# EasyEDA schematic SCH_PROJETO-AFC-(LAYOUT-ATUALIZADO-002)_2026-01-30.json
TITLE: AFC TEENSY; REV: 1.0; Date: 2026-01-28; Sheet: 1/1; Drawn By: ALLYSON TULIO; Company: ALPHA SUBSEA
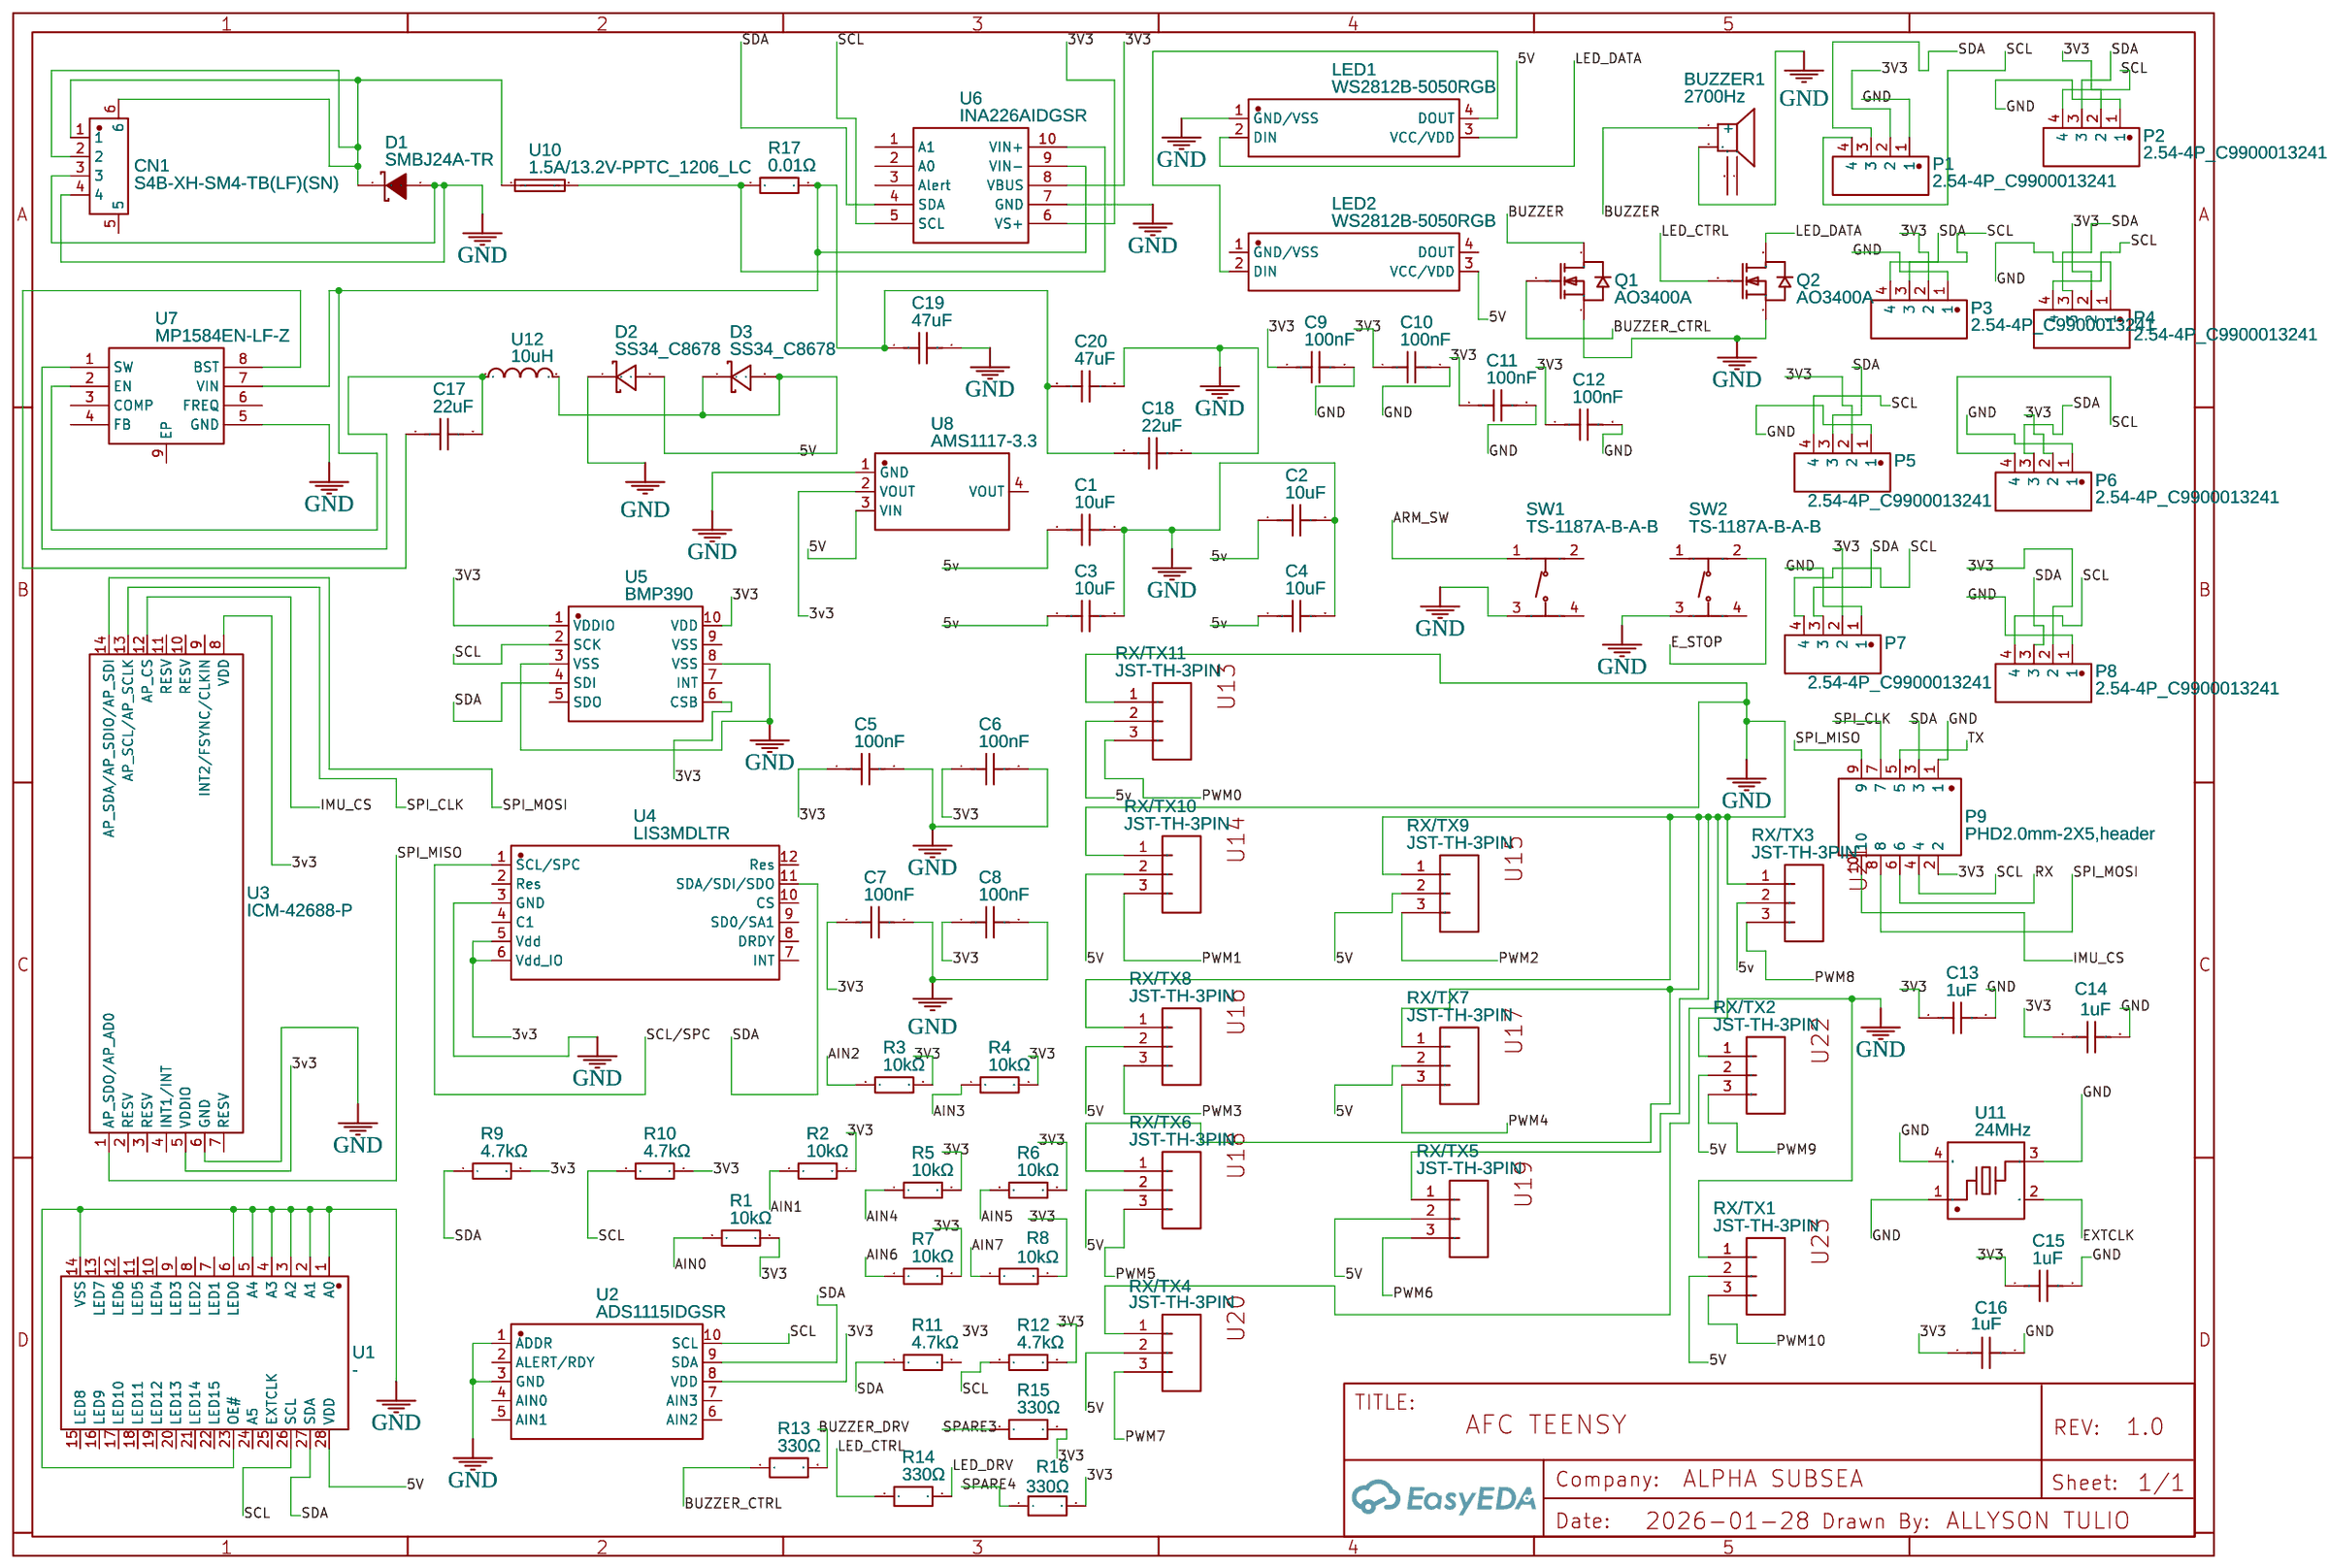
[diagram p0: schematic sheet]

## Parts
BUZZER1  2700Hz  [BUZ-SMD_4P-L8.5-W8.5-P8.50-BR]
C1  10uF  [C0805]
C2  10uF  [C0805]
C3  10uF  [C0805]
C4  10uF  [C0805]
C5  100nF  [C0402]
C6  100nF  [C0402]
C7  100nF  [C0402]
C8  100nF  [C0402]
C9  100nF  [C0402]
C10  100nF  [C0402]
C11  100nF  [C0402]
C12  100nF  [C0402]
C13  1uF  [C0402]
C14  1uF  [C0402]
C15  1uF  [C0402]
C16  1uF  [C0402]
C17  22uF  [C0805]
C18  22uF  [C0805]
C19  47uF  [C1206]
C20  47uF  [C1206]
CN1  S4B-XH-SM4-TB(LF)(SN)  [CONN-SMD_S4B-XH-SM4-TB-LF-SN]
D1  SMBJ24A-TR  [SMB_L4.6-W3.6-LS5.3-RD]
D2  SS34_C8678  [SMA_L4.3-W2.6-LS5.2-RD]
D3  SS34_C8678  [SMA_L4.3-W2.6-LS5.2-RD]
LED1  WS2812B-5050RGB  [LED-SMD_4P-L5.0-W5.0-BR_WS2812B-5050RGB]
LED2  WS2812B-5050RGB  [LED-SMD_4P-L5.0-W5.0-BR_WS2812B-5050RGB]
P1  2.54-4P_C9900013241  [CONN-TH_B4B-XH-A-BK-LF-SN]
P2  2.54-4P_C9900013241  [CONN-TH_B4B-XH-A-BK-LF-SN]
P3  2.54-4P_C9900013241  [CONN-TH_B4B-XH-A-BK-LF-SN]
P4  2.54-4P_C9900013241  [CONN-TH_B4B-XH-A-BK-LF-SN]
P5  2.54-4P_C9900013241  [CONN-TH_B4B-XH-A-BK-LF-SN]
P6  2.54-4P_C9900013241  [CONN-TH_B4B-XH-A-BK-LF-SN]
P7  2.54-4P_C9900013241  [CONN-TH_B4B-XH-A-BK-LF-SN]
P8  2.54-4P_C9900013241  [CONN-TH_B4B-XH-A-BK-LF-SN]
P9  PHD2.0mm-2X5,header  [CONN-TH_10P-P2.00_PHD2.0MM-2X5]
Q1  AO3400A  [SOT-23-3_L2.9-W1.3-P1.90-LS2.4-BR]
Q2  AO3400A  [SOT-23-3_L2.9-W1.3-P1.90-LS2.4-BR]
R1  10kΩ  [R0402]
R2  10kΩ  [R0402]
R3  10kΩ  [R0402]
R4  10kΩ  [R0402]
R5  10kΩ  [R0402]
R6  10kΩ  [R0402]
R7  10kΩ  [R0402]
R8  10kΩ  [R0402]
R9  4.7kΩ  [R0402]
R10  4.7kΩ  [R0402]
R11  4.7kΩ  [R0402]
R12  4.7kΩ  [R0402]
R13  330Ω  [R0402]
R14  330Ω  [R0402]
R15  330Ω  [R0402]
R16  330Ω  [R0402]
R17  0.01Ω  [R2512]
RX/TX1  JST-TH-3PIN  [CONN-TH_3P-P2.50_B3B-XH-A-BK-LF-SN]
RX/TX2  JST-TH-3PIN  [CONN-TH_3P-P2.50_B3B-XH-A-BK-LF-SN]
RX/TX3  JST-TH-3PIN  [CONN-TH_3P-P2.50_B3B-XH-A-BK-LF-SN]
RX/TX4  JST-TH-3PIN  [CONN-TH_3P-P2.50_B3B-XH-A-BK-LF-SN]
RX/TX5  JST-TH-3PIN  [CONN-TH_3P-P2.50_B3B-XH-A-BK-LF-SN]
RX/TX6  JST-TH-3PIN  [CONN-TH_3P-P2.50_B3B-XH-A-BK-LF-SN]
RX/TX7  JST-TH-3PIN  [CONN-TH_3P-P2.50_B3B-XH-A-BK-LF-SN]
RX/TX8  JST-TH-3PIN  [CONN-TH_3P-P2.50_B3B-XH-A-BK-LF-SN]
RX/TX9  JST-TH-3PIN  [CONN-TH_3P-P2.50_B3B-XH-A-BK-LF-SN]
RX/TX10  JST-TH-3PIN  [CONN-TH_3P-P2.50_B3B-XH-A-BK-LF-SN]
RX/TX11  JST-TH-3PIN  [CONN-TH_3P-P2.50_B3B-XH-A-BK-LF-SN]
SW1  TS-1187A-B-A-B  [SW-SMD_4P-L5.1-W5.1-P3.70-LS6.5-TL_H1.5]
SW2  TS-1187A-B-A-B  [SW-SMD_4P-L5.1-W5.1-P3.70-LS6.5-TL_H1.5]
U1  -  [TSSOP-28_L9.7-W4.4-P0.65-LS6.4-TL]
U2  ADS1115IDGSR  [MSOP-10_L3.0-W3.0-P0.50-LS5.0-BL]
U3  ICM-42688-P  [LGA-14_L3.0-W2.5-P0.50-TL]
U4  LIS3MDLTR  [LGA-12_L2.0-W2.0-P0.50-BL]
U5  BMP390  [LGA-10_L2.0-W2.0-P0.50-BL]
U6  INA226AIDGSR  [MSOP-10_L3.0-W3.0-P0.50-LS5.0-BL]
U7  MP1584EN-LF-Z  [SOIC-8_L5.0-W4.0-P1.27-LS6.0-BL-EP2.0]
U8  AMS1117-3.3  [SOT-223-3_L6.5-W3.4-P2.30-LS7.0-BR]
U10  1.5A/13.2V-PPTC_1206_LC  [F1206]
U11  24MHz  [CRYSTAL-SMD_4P-L3.2-W2.5-BL]
U12  10uH  [IND-SMD_L5.4-W5.2]

## Library data of the parts
BUZZER1 = MLT-8530: Supplier: LCSC; Manufacturer: 华能; Supplier Part: C94599; JLCPCB Part Class: Extended Part
C1-C4 = CL21A106KAYNNNE: Supplier: LCSC; Manufacturer: SAMSUNG(三星); Supplier Part: C15850; JLCPCB Part Class: Basic Part
C5-C12 = CL05B104KO5NNNC: Supplier: LCSC; Manufacturer: SAMSUNG(三星); Supplier Part: C1525; JLCPCB Part Class: Basic Part
C13-C16 = CL05A105KA5NQNC: Supplier: LCSC; Manufacturer: SAMSUNG(三星); Supplier Part: C52923; JLCPCB Part Class: Basic Part
C17 C18 = CL21A226MAQNNNE: Supplier: LCSC; Manufacturer: SAMSUNG(三星); Supplier Part: C45783; JLCPCB Part Class: Basic Part
C19 C20 = TCC1206X5R476M100HT: Supplier: LCSC; Supplier Part: C5448950; Manufacturer: CCTC(三环); JLCPCB Part Class: Extended Part; Contributor: lcsc
CN1 = S4B-XH-SM4-TB(LF)(SN): Contributor: lcsc; Supplier: LCSC; Supplier Part: C5306499; Manufacturer: JST; JLCPCB Part Class: Extended Part
D1 = SMBJ24A-TR: Contributor: LCSC; Supplier: LCSC; Manufacturer: ST(意法半导体); Supplier Part: C133668; JLCPCB Part Class: Extended Part
D2 D3 = SS34_C8678: Supplier: LCSC; Manufacturer Part: SS34; Manufacturer: MDD(辰达半导体); Supplier Part: C8678; JLCPCB Part Class: Basic Part
LED1 LED2 = WS2812B-5050RGB: JLCPCB Part Class: Extended Part; Contributor: LCSC; Supplier: LCSC; Supplier Part: C2838584; Manufacturer: null
P1-P8 = 2.54-4P_C9900013241: Contributor: lcsc; Supplier: LCSC; Supplier Part: C9900013241; Manufacturer: null; Manufacturer Part: 2.54-4P; JLCPCB Part Class: Extended Part
P9 = PHD2.0mm-2X5,header: Supplier: LCSC; Manufacturer: BOOMELE(博穆精密); Manufacturer Part: PHD-2X5A; Supplier Part: C49123; JLCPCB Part Class: Extended Part
Q1 Q2 = AO3400A: Supplier: LCSC; Manufacturer: AOS; Supplier Part: C20917; JLCPCB Part Class: Basic Part
R1-R8 = 0402WGF1002TCE: Supplier: LCSC; Manufacturer: UNI-ROYAL(厚声); Supplier Part: C25744; JLCPCB Part Class: Basic Part
R9-R12 = 0402WGF4701TCE: Supplier: LCSC; Manufacturer: UNI-ROYAL(厚声); Supplier Part: C25900; JLCPCB Part Class: Basic Part
R13-R16 = 0402 ±5% 330Ω: Contributor: lcsc; Supplier: LCSC; Supplier Part: C2889360; Manufacturer: VO(翔胜); JLCPCB Part Class: Extended Part
R17 = MRF6432(2512)LR010JTS: Supplier Part: C76272; Supplier: LCSC; Manufacturer: SUP; JLCPCB Part Class: Extended Part
RX/TX1-RX/TX11 = JST XH 3P 2.54 PITCH: Manufacturer Part: JST-XH 3P; Contributor: jva2000
SW1 SW2 = TS-1187A-B-A-B: Contributor: LCSC; Supplier: LCSC; Supplier Part: C318884; Manufacturer: XKB Connection(中国星坤); JLCPCB Part Class: Basic Part
U1 = PCA9685PW,118: Contributor: LCSC; Supplier: LCSC; Supplier Part: C2678753; Manufacturer: NXP(恩智浦); JLCPCB Part Class: Extended Part
U2 = ADS1115IDGSR: Supplier: LCSC; Manufacturer: TI(德州仪器); Supplier Part: C37593; JLCPCB Part Class: Extended Part
U3 = ICM-42688-P: Contributor: LCSC; Supplier: LCSC; Supplier Part: C1850418; Manufacturer: TDK InvenSense(应美盛); JLCPCB Part Class: Extended Part
U4 = LIS3MDLTR: Contributor: LCSC; Supplier: LCSC; Supplier Part: C478483; Manufacturer: ST(意法半导体); JLCPCB Part Class: Extended Part
U5 = BMP390: Contributor: lcsc; Supplier: LCSC; Supplier Part: C9900016584; Manufacturer: null; JLCPCB Part Class: Extended Part
U6 = INA226AIDGSR: Supplier: LCSC; Manufacturer: TI(德州仪器); Supplier Part: C49851; JLCPCB Part Class: Extended Part
U7 = MP1584EN-LF-Z: Supplier: LCSC; Manufacturer: MPS(芯源); Supplier Part: C15051; JLCPCB Part Class: Extended Part
U8 = AMS1117-3.3: sourceId: dwIGgezVh; Supplier: LCSC; Manufacturer: AMS; Supplier Part: C6186; JLCPCB Part Class: Basic Part
U10 = 1.5A/13.2V-PPTC_1206_LC: Contributor: LCSC; Supplier: LCSC; Supplier Part: C9900007450; Manufacturer: null; JLCPCB Part Class: Extended Part
U11 = 7325-2400A1210-03: Supplier: LCSC; Supplier Part: C17701336; Manufacturer: XTY(新天源); JLCPCB Part Class: Extended Part; Contributor: lcsc
U12 = MWSA0503S-100MT: Contributor: LCSC; Supplier: LCSC; Supplier Part: C408412; Manufacturer: Sunlord(顺络); JLCPCB Part Class: Extended Part

## Nets
3V3: C5.1 C6.1 C7.1 C8.1 C9.1 C10.1 C11.1 C12.1 C13.1 C14.1 C15.1 C16.1 P1.2 P2.2 P3.2 P4.2 P5.2 P6.2 P7.2 P8.2 P9.2 R1.2 R2.2 R3.2 R4.2 R5.2 R6.2 R7.2 R8.2 R10.2 R12.2 R15.2 R16.2 U2.8(VDD) U5.1(VDDIO) U5.6(CSB) U5.10(VDD) U6.6(VS+) U6.8(VBUS)
3v3: R9.2 U3.5(VDDIO) U3.8(VDD) U4.5(Vdd) U4.6(Vdd_IO) U8.2(VOUT)
5V: D2.2(A) D3.1(K) D3.2(A) LED1.3(VCC/VDD) LED2.3(VCC/VDD) RX/TX1.2 RX/TX2.2 RX/TX4.2 RX/TX5.2 RX/TX6.2 RX/TX7.2 RX/TX8.2 RX/TX9.2 RX/TX10.2 U1.28(VDD) U8.3(VIN) U12.2
5v: C1.1 C2.1 C3.1 C4.1 RX/TX3.2 RX/TX11.2
GND: BUZZER1.2 C1.2 C2.2 C3.2 C4.2 C5.2 C6.2 C7.2 C8.2 C9.2 C10.2 C11.2 C12.2 C13.2 C14.2 C15.2 C16.2 C18.2 C19.2 C20.2 CN1.3 CN1.4 D1.2(A) D2.1(K) LED1.1(GND/VSS) P1.1 P2.1 P3.1 P4.1 P5.1 P6.1 P7.1 P8.1 P9.1 Q1.2(S) Q2.2(S) RX/TX1.1 RX/TX2.1 RX/TX3.1 RX/TX4.1 RX/TX5.1 RX/TX6.1 RX/TX7.1 RX/TX8.1 RX/TX9.1 RX/TX10.1 RX/TX11.1 SW1.3(C) SW2.3(C) U1.1(A0) U1.2(A1) U1.3(A2) U1.4(A3) U1.5(A4) U1.6(LED0) U1.14(VSS) U1.23(OE#) U2.1(ADDR) U2.3(GND) U3.6(GND) U4.3(GND) U5.3(VSS) U5.8(VSS) U6.7(GND) U7.5(GND) U8.1(GND) U11.1 U11.3 U11.4(GND)
AIN0: R1.1
AIN1: R2.1
AIN2: R3.1
AIN3: R4.1
AIN4: R5.1
AIN5: R6.1
AIN6: R7.1
AIN7: R8.1
ARM_SW: SW1.1(A)
BUZZER: BUZZER1.1(+) Q1.3(D)
BUZZER_CTRL: Q1.1(G) R13.1
BUZZER_DRV: R13.2
E_STOP: SW2.2(B)
EXTCLK: U11.2(GND)
IMU_CS: P9.10 U3.12(AP_CS)
LED_CTRL: Q2.1(G) R14.1
LED_DATA: LED1.2(DIN) Q2.3(D)
LED_DRV: R14.2
PWM0: RX/TX11.3
PWM1: RX/TX10.3
PWM2: RX/TX9.3
PWM3: RX/TX8.3
PWM4: RX/TX7.3
PWM5: RX/TX6.3
PWM6: RX/TX5.3
PWM7: RX/TX4.3
PWM8: RX/TX3.3
PWM9: RX/TX2.3
PWM10: RX/TX1.3
RX: P9.6
SCL: P1.4 P2.4 P3.4 P4.4 P5.4 P6.4 P7.4 P8.4 P9.4 R10.1 R12.1 U1.26(SCL) U2.10(SCL) U5.2(SCK) U6.5(SCL)
SCL/SPC: U4.1(SCL/SPC)
SDA: P1.3 P2.3 P3.3 P4.3 P5.3 P6.3 P7.3 P8.3 P9.3 R9.1 R11.1 U1.27(SDA) U2.9(SDA) U4.11(SDA/SDI/SDO) U5.4(SDI) U6.4(SDA)
SPARE3: R15.1
SPARE4: R16.1
SPI_CLK: P9.7 U3.13(AP_SCL/AP_SCLK)
SPI_MISO: P9.9 U3.1(AP_SDO/AP_AD0)
SPI_MOSI: P9.8 U3.14(AP_SDA/AP_SDIO/AP_SDI)
TX: P9.5
Net-(C17-1): C17.1 U7.8(BST)
Net-(C17-2): C17.2 U7.1(SW) U12.1
Net-(C18-1): C18.1 C19.1 C20.1 R17.2 U6.9(VIN-) U7.2(EN) U7.7(VIN)
Net-(CN1-1): CN1.1 CN1.2 CN1.6 D1.1(K) U10.1
Net-(LED1-4): LED1.4(DOUT) LED2.2(DIN)
Net-(R17-1): R17.1 U6.10(VIN+) U10.2

Not connected (* = marked no-connect by the designer): BUZZER1 3 4; CN1 5; LED2 1(GND/VSS) 4(DOUT); R11 2; SW1 2(B) 4(D); SW2 1(A) 4(D); U1 7(LED1) 8(LED2) 9(LED3) 10(LED4) 11(LED5) 12(LED6) 13(LED7) 15(LED8) 16(LED9) 17(LED10) 18(LED11) 19(LED12) 20(LED13) 21(LED14) 22(LED15) 24(A5) 25(EXTCLK); U2 2(ALERT/RDY) 4(AIN0) 5(AIN1) 6(AIN2) 7(AIN3); U3 2(RESV) 3(RESV) 4(INT1/INT) 7(RESV) 9(INT2/FSYNC/CLKIN) 10(RESV) 11(RESV); U4 2(Res) 4(C1) 7(INT) 8(DRDY) 9(SD0/SA1) 10(CS) 12(Res); U5 5(SDO) 7(INT) 9(VSS); U6 1(A1) 2(A0) 3(Alert); U7 3(COMP) 4(FB) 6(FREQ) 9(EP); U8 4(VOUT)
